# EAGLE design MAX86141_HEG_MINI_HEADPIECE (EAGLE 9.5.1)
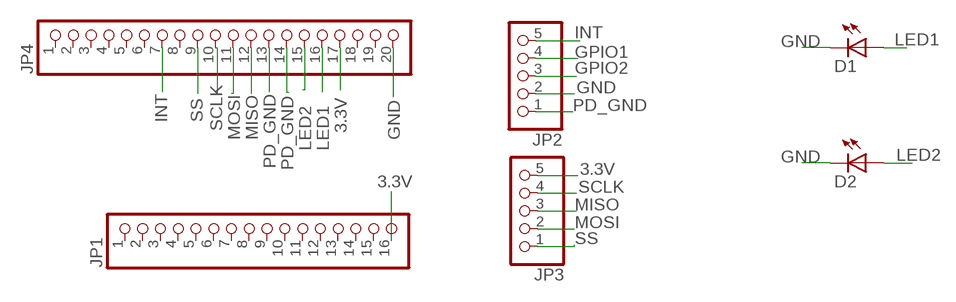
[diagram p0: schematic, sheet 1]

## Parts
D1  LED1206  [LED-1206]
D2  LED1206  [LED-1206]
JP1  PINHD-1X16  [1X16]
JP2  PINHD-1X5  [1X05]
JP3  PINHD-1X5  [1X05]
JP4  PINHD-1X20  [1X20]

## Nets
3.3V: JP1.16 JP3.5 JP4.17
GND: D1.C D2.C JP2.2 JP4.20
GPIO1: JP2.4
GPIO2: JP2.3
INT: JP2.5 JP4.7
LED1: D1.A JP4.16
LED2: D2.A JP4.15
MISO: JP3.3 JP4.12
MOSI: JP3.2 JP4.11
PD_GND: JP2.1 JP4.13 JP4.14
SCLK: JP3.4 JP4.10
SS: JP3.1 JP4.9
Unconnected: JP1.1 JP1.2 JP1.3 JP1.4 JP1.5 JP1.6 JP1.7 JP1.8 JP1.9 JP1.10 JP1.11 JP1.12 JP1.13 JP1.14 JP1.15 JP4.1 JP4.2 JP4.3 JP4.4 JP4.5 JP4.6 JP4.8 JP4.18 JP4.19

## Library data of the parts
D1 D2 = epic:LED: LEDs Standard schematic elements and footprints for 5mm, 3mm, 1206, and 0603 sized LEDs. 5mm - Spark Fun Electronics SKU : COM-00529 (and others)
JP1 = pinhead:PINHD-1X16: PIN HEADER
JP2 JP3 = pinhead:PINHD-1X5: PIN HEADER
JP4 = pinhead:PINHD-1X20: PIN HEADER

## Board
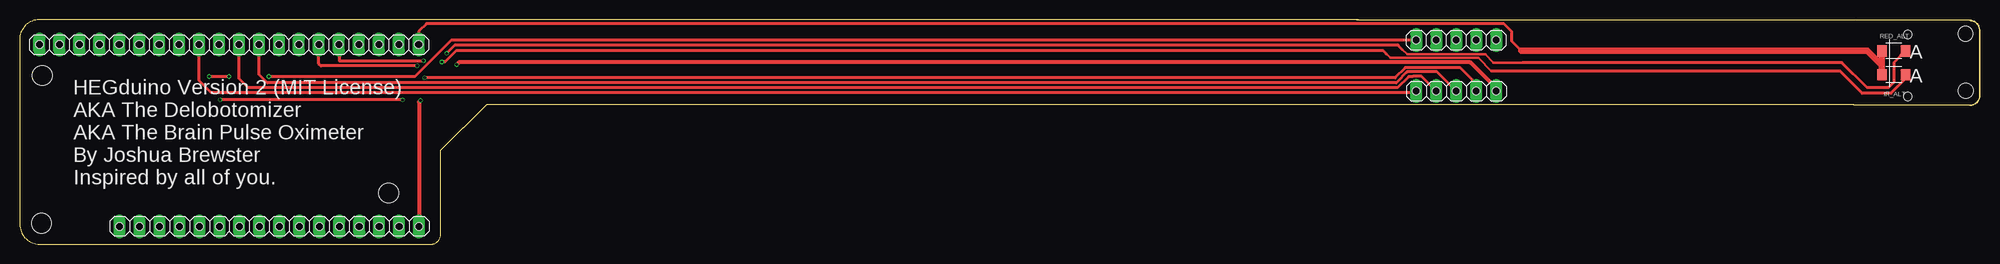
[diagram p1: board, top side]
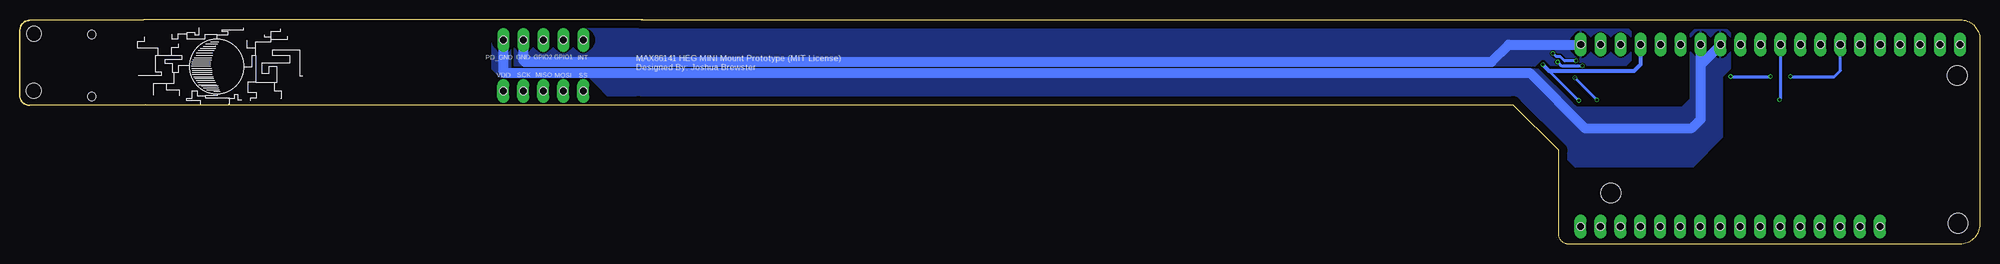
[diagram p2: board, bottom side, seen from below]

Size 249.43 x 28.58 mm. Coordinates in mm from the lower left corner, seen from the top.
Outline: 170.69,17.78 233.4,17.78 248.16,17.68 arc90 249.43,18.95 249.4,27.2 arc90 248.13,28.47 233.63,28.58 170.13,28.58 170.38,28.58 2.49,28.58 arc90 0,26.04 0.03,2.54 arc90 2.51,0 52.3,0 arc90 53.57,1.27 53.57,11.94 59.41,17.78 177.77,17.78
Copper layers (1*16): Top 0.035mm / dielectric 1.5mm / Bottom 0.035mm
Design rules "default *": minimum track width 6mil, minimum drill 0.35mm, track to track 6mil, track to pad 6mil, pad to pad 6mil, via to via 2mil, smd to smd 6mil, copper to edge 40mil, drill to drill 6mil, minimum pad ring 10mil, minimum via ring 3mil, stop-mask expansion 4mil, vias tented up to drill 0mil, thermal gap 10mil
Holes 1.1 mm at 240.26,18.8 240.26,26.67
Holes 0.99 mm at 2.51,25.4 5.05,25.4 7.59,25.4 10.13,25.4 20.29,25.4 17.75,25.4 15.21,25.4 12.67,25.4 30.45,25.4 27.91,25.4 25.37,25.4 22.83,25.4 40.61,25.4 38.07,25.4 35.53,25.4 32.99,25.4 50.77,25.4 48.23,25.4 45.69,25.4 43.15,25.4 43.21,2.29 45.75,2.29 48.29,2.29 50.83,2.29 33.05,2.29 35.59,2.29 38.13,2.29 40.67,2.29 22.89,2.29 25.43,2.29 27.97,2.29 30.51,2.29 12.73,2.29 15.27,2.29 17.81,2.29 20.35,2.29 177.72,25.98 180.26,25.98 182.8,25.98 185.34,25.98 187.88,25.98 187.88,19.48 185.34,19.48 182.8,19.48 180.26,19.48 177.72,19.48
Holes 2.54 mm at 2.79,2.67 2.87,21.46 46.96,6.53
Holes 1.91 mm at 247.6,26.77 247.62,19.53

### Footprints (pad centres in the part's own frame; a part is rotated, then mirrored left to right if it is on the bottom)
LED-1206 = smd 1.2 x 1.4: A -1.5,0; C 1.5,0
1X16 = drill 1.016 long: 1 -19.05,0; 2 -16.51,0; 3 -13.97,0; 4 -11.43,0; 5 -8.89,0; 6 -6.35,0; 7 -3.81,0; 8 -1.27,0; 9 1.27,0; 10 3.81,0; 11 6.35,0; 12 8.89,0; 13 11.43,0; 14 13.97,0; 15 16.51,0; 16 19.05,0
1X05 = drill 1.016 long: 1 -5.08,0; 2 -2.54,0; 3 0,0; 4 2.54,0; 5 5.08,0
1X20 = drill 1.016 long: 1 -24.13,0; 2 -21.59,0; 3 -19.05,0; 4 -16.51,0; 5 -13.97,0; 6 -11.43,0; 7 -8.89,0; 8 -6.35,0; 9 -3.81,0; 10 -1.27,0; 11 1.27,0; 12 3.81,0; 13 6.35,0; 14 8.89,0; 15 11.43,0; 16 13.97,0; 17 16.51,0; 18 19.05,0; 19 21.59,0; 20 24.13,0

### Placement (x,y rotation side)
D1  238.46,24.59 180 top
D2  238.46,21.54 180 top
JP1  31.78,2.29 0 top
JP2  182.8,25.98 180 top
JP3  182.8,19.48 0 top
JP4  26.64,25.4 0 top

### Tracks (layer width: path | path; a pad name or v marks a point on that pad's centre or on a via)
3.3V  (via drill 0.35)
  Top 0.508: JP3.5 187.88,19.84 184.58,23.14 55.88,23.14 v55.6,22.86 | v51.03,18.29 50.83,18.09 JP1.16
  Bottom 0.406: 54.84,22.07 51.05,18.29 v51.03,18.29
  Bottom 0.508: v55.6,22.86 54.81,22.07 | 54.84,22.07 54.81,22.07 | 54.81,22.07 43.97,22.07 43.15,22.89 JP4.17
GND
  Top 0.406: 191.06,24.64 189.86,25.83 189.86,27.05 188.85,28.07 51.77,28.07 50.77,27.08 JP4.20
  Top 0.813: D2.C 236.96,22.76 | 236.96,22.76 D1.C | 236.96,22.76 235.08,24.64 191.06,24.64
  Bottom 1.27: JP2.2 185.34,23.39 185.17,23.22 62.13,23.22 59.94,25.4 JP4.20
  pour Bottom: 186.51,28.58 186.51,22.68 56.57,22.68 55.73,23.52 55.4,23.52 54.64,22.76 45.01,22.76 44.37,23.39 44.37,27.05 45.9,28.58
INT  (via drill 0.35)
  Top 0.406: JP2.5 54.91,25.98 50.27,21.34 v31.72,21.34 | v26.64,21.34 v24.1,21.34
  Bottom 0.406: v31.72,21.34 v26.64,21.34 | v24.1,21.34 18.52,21.34 17.75,22.1 JP4.7
LED1  (via drill 0.35)
  Top 0.305: 191.24,23.11 187.55,23.11 186.51,24.16 176.56,24.16 175.95,24.77
  Top 0.406: D1.A 238.48,23.11 238.48,20.6 237.79,19.91 235.08,19.91 231.88,23.11 191.24,23.11 | 175.95,24.77 175.39,25.32 55.37,25.32 v54.33,24.28 | v51.38,23.34 40.67,23.34 40.67,25.35 JP4.16
  Bottom 0.406: v54.33,24.28 53.95,23.9 53.42,23.9 52.86,23.34 v51.38,23.34
LED2  (via drill 0.35)
  Top 0.305: 187.27,22.02 185.6,23.7 174.42,23.7 173.89,24.23
  Top 0.406: D2.A 239.96,21.06 238.1,19.2 234.47,19.2 231.65,22.02 187.27,22.02 | 173.89,24.23 173.53,24.59 55.52,24.59 54.13,23.19 v53.72,23.19 | v50.57,22.71 38.35,22.71 38.07,22.99 JP4.15
  Bottom 0.406: v53.72,23.19 53.24,22.71 v50.57,22.71
MISO
  Top 0.406: JP3.3 180.37,21.92 176.55,21.92 175.16,20.52 31.52,20.52 30.45,21.59 JP4.12
MOSI
  Top 0.406: JP3.2 178.38,21.36 177.26,21.36 177.24,21.34 176.76,21.34 175.34,19.91 29.08,19.91 27.91,21.08 JP4.11
PD_GND
  Bottom 1.27: JP2.1 187.88,22.02 187.66,21.79 57.28,21.79 50.27,14.78 36.65,14.78 35.53,15.9 35.53,22.81 | 35.53,22.81 JP4.14 | 35.53,22.81 32.99,25.35 JP4.13
  pour Bottom: 186.94,27.69 186.94,22.35 56.21,22.35 51.92,18.06 51.92,18.03 51.36,17.48 37.85,17.48 36.83,18.49 36.83,26.8 35.94,27.69 32.49,27.69 31.72,26.92 31.72,22.35 32.74,21.34 32.74,13.64 36.55,9.83 51.46,9.83 59.41,17.78 173.51,17.78 176.91,21.18 188.24,21.18 189.33,22.28 189.33,26.9 188.54,27.69
SCLK  (via drill 0.35)  (1 unrouted)
  Top 0.406: JP3.4 185.34,20.45 183.31,22.48 176.32,22.48 175.03,21.18 v51.54,21.18 | v48.74,18.36 25.53,18.36 v25.5,18.39
  Bottom 0.406: v51.54,21.19 48.74,18.4 v48.74,18.36 | JP4.10 25.37,18.52 v25.5,18.39
SS
  Top 0.406: JP3.1 177.55,19.3 24.36,19.3 22.83,20.83 JP4.9

### Text on the board
tPlace: RED_ALT | IR_ALT
tNames: HEGduino Version 2 (MIT License) / AKA The Delobotomizer / AKA The Brain Pulse Oximeter / By Joshua Brewster / Inspired by all of you.
bNames: INT | GPIO1 | GPIO2 | GND | PD_GND | MAX86141 HEG MINI Mount Prototype (MIT License) / Designed By: Joshua Brewster | SS | MOSI | MISO | SCK | VDD
Document: 15 / 2 / GND / 0 / 4 / 16 / 17 / 3.3V | 5 / 18 / 23 / 19 / GND / GND / 21 / 22 / 3.3V | RX / TX / GND | Flexible MAX86141 HEG Mini Prototype / Joshua Brewster - MIT License | GND / 5V / 13 / 12 / 14 | 27 / 26 / 25 / 35 / 34 / 33 / 32 / 39 / 36 / EN | 3.3V